# EAGLE schematic burglar alarm (EAGLE 6.5.0)
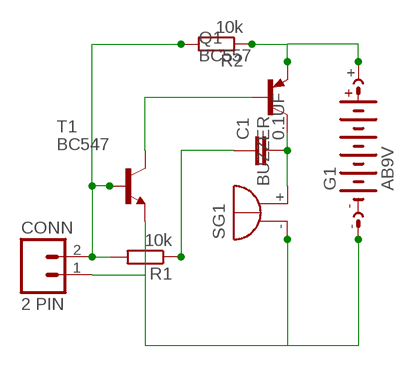
[diagram p0: schematic, sheet 1]

## Parts
C1  0.1UF  C2.5/2  [C2.5-2]
CONN  2 PIN  M02  [02P]
G1  AB9V  [AB9V]
Q1  BC557  [TO92]
R1  10k  R-EU_0204/5  [0204/5]
R2  10k  R-EU_0204/5  [0204/5]
SG1  BUZZER  F/QMB  [F/QMB]
T1  BC547  [TO92]

## Nets
N$1: C1.2 Q1.3(C) SG1.+(-)
N$2: C1.1 R1.1
N$3: CONN.1 G1.- SG1.-(+) T1.1(E)
N$4: CONN.2 R1.2 R2.2 T1.2(B)
N$5: G1.+ Q1.1(E) R2.1
N$6: Q1.2(B) T1.3(C)

## Library data of the parts
C1 = capacitor-wima:C: CAPACITOR naming: grid - package width
CONN = con-amp-quick:M02: AMP QUICK CONNECTOR; OC_FARNELL: unknown; OC_NEWARK: unknown
G1 = battery:AB9V: 9-V BATTERY CLIP
Q1 = transistor-pnp:BC557: PNP Transistor
R1 R2 = resistor:R-EU_: RESISTOR, European symbol
SG1 = buzzer:F/QMB: BUZZER Source: Buerklin; OC_FARNELL: unknown; OC_NEWARK: unknown
T1 = transistor:BC547: NPN TRANSISTOR